# EAGLE schematic sw-4416-project-v1 (EAGLE 6.2)
ECE 4416 Design Project: Wireless Control Utilizing Head Movement
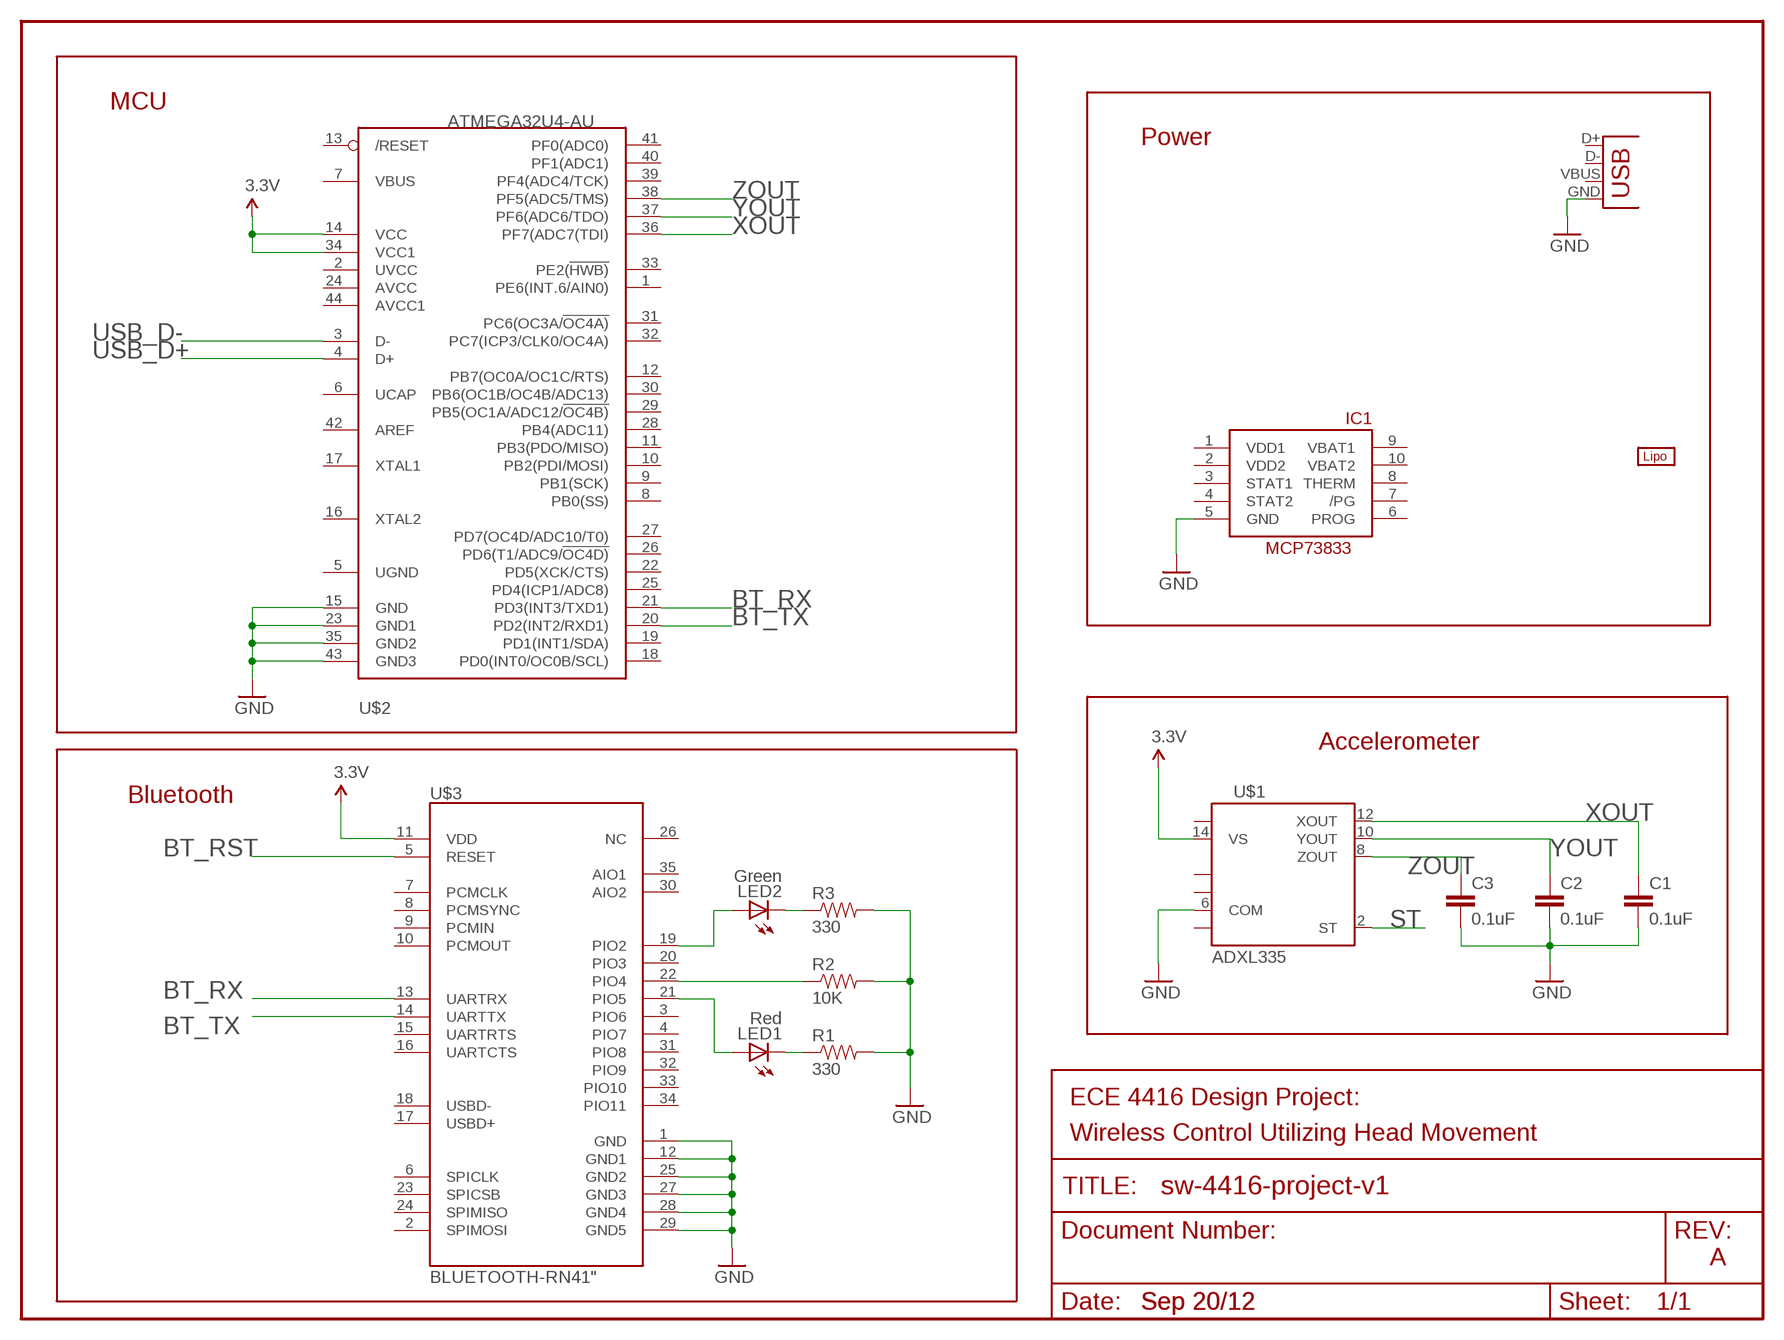
[diagram p0: schematic, sheet 1]
FRAME1 (FRAME-LETTER): LAST_DATE_TIME: Sep 20/12

## Parts
C1  0.1uF  CAP0603-CAP  [0603-CAP]
C2  0.1uF  CAP0603-CAP  [0603-CAP]
C3  0.1uF  CAP0603-CAP  [0603-CAP]
IC1  MCP73833-UN  [MSOP10]
LED1  Red  LED0603  [LED-0603]
LED2  Green  LED0603  [LED-0603]
R1  330  RESISTOR0603-RES  [0603-RES]
R2  10K  RESISTOR0603-RES  [0603-RES]
R3  330  RESISTOR0603-RES  [0603-RES]
U$1  ADXL335  [LFCSP-16]
U$2  ATMEGA32U4-AU  [TQFP44]
U$3  BLUETOOTH-RN41"  [RN41]
U$4  LIPO-OUTLINE1100  [LIPO-1100]
X1  USB-MICROB  [USB-MICROB]

## Nets
BT_RST: U$3.5(RESET)
BT_RX: U$2.21(PD3(INT3/TXD1)) U$3.13(UARTRX)
BT_TX: U$2.20(PD2(INT2/RXD1)) U$3.14(UARTTX)
GND: C1.2 C2.2 C3.2 IC1.5(GND) R1.2 R2.2 R3.2 U$1.6(COM) U$2.15(GND) U$2.23(GND1) U$2.35(GND2) U$2.43(GND3) U$3.1(GND) U$3.12(GND1) U$3.25(GND2) U$3.27(GND3) U$3.28(GND4) U$3.29(GND5) X1.GND
N$1: LED2.C R3.1
N$2: LED1.C R1.1
N$3: R2.1 U$3.22(PIO4)
N$4: LED2.A U$3.19(PIO2)
N$5: LED1.A U$3.21(PIO5)
ST: U$1.2(ST)
USB_D+: U$2.4(D+)
USB_D-: U$2.3(D-)
VCC: U$1.14(VS) U$2.14(VCC) U$2.34(VCC1) U$3.11(VDD) ; supply symbol labelled 3.3V
XOUT: C1.1 U$1.12(XOUT) U$2.36(PF7(ADC7(TDI))
YOUT: C2.1 U$1.10(YOUT) U$2.37(PF6(ADC6/TDO))
ZOUT: C3.1 U$1.8(ZOUT) U$2.38(PF5(ADC5/TMS))
Unconnected: IC1.3(STAT1) IC1.4(STAT2) IC1.6(PROG) IC1.7(/PG) IC1.8(THERM) IC1.9(VBAT1) IC1.10(VBAT2) U$1.3(COM) U$1.5(COM) U$1.7(COM) U$1.15(VS) U$2.1(PE6(INT.6/AIN0)) U$2.2(UVCC) U$2.5(UGND) U$2.6(UCAP) U$2.7(VBUS) U$2.8(PB0(SS)) U$2.9(PB1(SCK)) U$2.10(PB2(PDI/MOSI)) U$2.11(PB3(PDO/MISO)) U$2.12(PB7(OC0A/OC1C/RTS)) U$2.13(/RESET) U$2.16(XTAL2) U$2.17(XTAL1) U$2.18(PD0(INT0/OC0B/SCL)) U$2.19(PD1(INT1/SDA)) U$2.22(PD5(XCK/CTS)) U$2.24(AVCC) U$2.25(PD4(ICP1/ADC8)) U$2.26(PD6(T1/ADC9/!OC4D)) U$2.27(PD7(OC4D/ADC10/T0)) U$2.28(PB4(ADC11)) U$2.29(PB5(OC1A/ADC12/!OC4B)) U$2.30(PB6(OC1B/OC4B/ADC13)) U$2.31(PC6(OC3A/!OC4A)) U$2.32(PC7(ICP3/CLK0/OC4A)) U$2.33(PE2(!HWB)) U$2.39(PF4(ADC4/TCK)) U$2.40(PF1(ADC1)) U$2.41(PF0(ADC0)) U$2.42(AREF) U$2.44(AVCC1) U$3.2(SPIMOSI) U$3.3(PIO6) U$3.4(PIO7) U$3.6(SPICLK) U$3.7(PCMCLK) U$3.8(PCMSYNC) U$3.9(PCMIN) U$3.10(PCMOUT) U$3.15(UARTRTS) U$3.16(UARTCTS) U$3.17(USBD+) U$3.18(USBD-) U$3.20(PIO3) U$3.23(SPICSB) U$3.24(SPIMISO) U$3.26(NC) U$3.30(AIO2) U$3.31(PIO8) U$3.32(PIO9) U$3.33(PIO10) U$3.34(PIO11) U$3.35(AIO1) X1.D+ X1.D- X1.VBUS

## Notes on the sheet
- MCU
- Power
- Accelerometer
- Bluetooth
- ECE 4416 Design Project:
- Wireless Control Utilizing Head Movement
- A

## Power pins joined to a net without a drawn wire
VDD1: IC1.1(VDD1)
VDD2: IC1.2(VDD2)

## Library data of the parts
C1-C3 = SparkFun:CAP: Capacitor Standard 0603 ceramic capacitor, and 0.1" leaded capacitor.
IC1 = adafruit:MCP73833
LED1 LED2 = SparkFun:LED: LEDs Standard schematic elements and footprints for 5mm, 3mm, 1206, and 0603 sized LEDs. 5mm - Spark Fun Electronics SKU : COM-00529 (and others)
R1-R3 = SparkFun:RESISTOR: Resistor Basic schematic elements and footprints for 0603, 1206, and PTH resistors.
U$1 = SparkFun:ADXL335
U$2 = adafruit:ATMEGA32U4: http://www.ladyada.net/library/eagle
U$3 = SparkFun:BLUETOOTH-RN41
U$4 = SparkFun:LIPO-OUTLINE
X1 = SparkFun:USB: USB Connectors USB-B-PTH is fully proven SKU : PRT-00139 USB-miniB is fully proven SKU : PRT-00587 USB-A-PCB is untested. USB-A-H is throughly reviewed, but untested. Spark Fun Electronics SKU : PRT-00437 USB-B-SMT is throughly reviewed, but untested. Needs silkscreen touching up. USB-A-S has not been used/tested USB-MB-H has not been used/tested